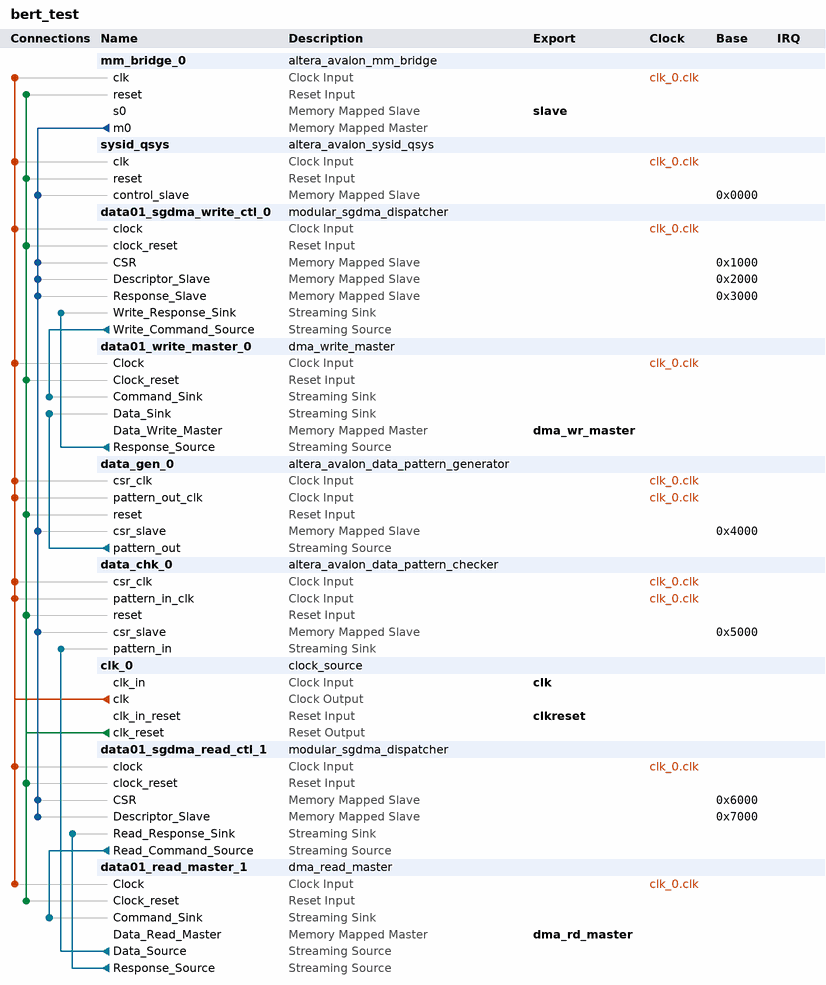
[diagram p0: system contents]
# Platform Designer (Qsys) system bert_test, Cyclone V 5CSXFC6C6U23C7
# Parameters at their usual value, and those the tool derives, are not listed.
package require -exact qsys 13.1
create_system bert_test
set_project_property DEVICE_FAMILY {Cyclone V}
set_project_property DEVICE 5CSXFC6C6U23C7

add_instance mm_bridge_0 altera_avalon_mm_bridge 13.1
set_instance_parameter_value mm_bridge_0 DATA_WIDTH 32
set_instance_parameter_value mm_bridge_0 ADDRESS_WIDTH 15
set_instance_parameter_value mm_bridge_0 ADDRESS_UNITS SYMBOLS
set_instance_parameter_value mm_bridge_0 MAX_PENDING_RESPONSES 4

add_instance sysid_qsys altera_avalon_sysid_qsys 13.1
set_instance_parameter_value sysid_qsys id 538181927

add_instance data01_sgdma_write_ctl_0 modular_sgdma_dispatcher 1.0
set_instance_parameter_value data01_sgdma_write_ctl_0 MODE 2
set_instance_parameter_value data01_sgdma_write_ctl_0 GUI_RESPONSE_PORT 0
set_instance_parameter_value data01_sgdma_write_ctl_0 DESCRIPTOR_FIFO_DEPTH 128
set_instance_parameter_value data01_sgdma_write_ctl_0 ENHANCED_FEATURES 1
set_instance_parameter_value data01_sgdma_write_ctl_0 CSR_ADDRESS_WIDTH 3

add_instance data01_write_master_0 dma_write_master 1.0
set_instance_parameter_value data01_write_master_0 DATA_WIDTH 64
set_instance_parameter_value data01_write_master_0 LENGTH_WIDTH 32
set_instance_parameter_value data01_write_master_0 FIFO_DEPTH 1024
set_instance_parameter_value data01_write_master_0 STRIDE_ENABLE 0
set_instance_parameter_value data01_write_master_0 GUI_STRIDE_WIDTH 1
set_instance_parameter_value data01_write_master_0 BURST_ENABLE 1
set_instance_parameter_value data01_write_master_0 GUI_MAX_BURST_COUNT 256
set_instance_parameter_value data01_write_master_0 GUI_PROGRAMMABLE_BURST_ENABLE 0
set_instance_parameter_value data01_write_master_0 GUI_BURST_WRAPPING_SUPPORT 1
set_instance_parameter_value data01_write_master_0 TRANSFER_TYPE {Aligned Accesses}
set_instance_parameter_value data01_write_master_0 PACKET_ENABLE 0
set_instance_parameter_value data01_write_master_0 ERROR_ENABLE 0
set_instance_parameter_value data01_write_master_0 ERROR_WIDTH 8
set_instance_parameter_value data01_write_master_0 ADDRESS_WIDTH 32
set_instance_parameter_value data01_write_master_0 FIFO_SPEED_OPTIMIZATION 1

add_instance data_gen_0 altera_avalon_data_pattern_generator 13.1
set_instance_parameter_value data_gen_0 ST_DATA_W 64
set_instance_parameter_value data_gen_0 BYPASS_ENABLED false
set_instance_parameter_value data_gen_0 AVALON_ENABLED true
set_instance_parameter_value data_gen_0 FREQ_CNTER_ENABLED false
set_instance_parameter_value data_gen_0 CROSS_CLK_SYNC_DEPTH 2

add_instance data_chk_0 altera_avalon_data_pattern_checker 13.1
set_instance_parameter_value data_chk_0 ST_DATA_W 64
set_instance_parameter_value data_chk_0 NUM_CYCLES_FOR_LOCK 40
set_instance_parameter_value data_chk_0 BYPASS_ENABLED false
set_instance_parameter_value data_chk_0 AVALON_ENABLED true
set_instance_parameter_value data_chk_0 FREQ_CNTER_ENABLED false
set_instance_parameter_value data_chk_0 CROSS_CLK_SYNC_DEPTH 2

add_instance clk_0 clock_source 13.1
set_instance_parameter_value clk_0 clockFrequency 100000000

add_instance data01_sgdma_read_ctl_1 modular_sgdma_dispatcher 1.0
set_instance_parameter_value data01_sgdma_read_ctl_1 MODE 1
set_instance_parameter_value data01_sgdma_read_ctl_1 GUI_RESPONSE_PORT 0
set_instance_parameter_value data01_sgdma_read_ctl_1 DESCRIPTOR_FIFO_DEPTH 128
set_instance_parameter_value data01_sgdma_read_ctl_1 ENHANCED_FEATURES 1
set_instance_parameter_value data01_sgdma_read_ctl_1 CSR_ADDRESS_WIDTH 3

add_instance data01_read_master_1 dma_read_master 1.0
set_instance_parameter_value data01_read_master_1 DATA_WIDTH 64
set_instance_parameter_value data01_read_master_1 LENGTH_WIDTH 32
set_instance_parameter_value data01_read_master_1 FIFO_DEPTH 2048
set_instance_parameter_value data01_read_master_1 STRIDE_ENABLE 0
set_instance_parameter_value data01_read_master_1 GUI_STRIDE_WIDTH 1
set_instance_parameter_value data01_read_master_1 BURST_ENABLE 1
set_instance_parameter_value data01_read_master_1 GUI_MAX_BURST_COUNT 512
set_instance_parameter_value data01_read_master_1 GUI_PROGRAMMABLE_BURST_ENABLE 0
set_instance_parameter_value data01_read_master_1 GUI_BURST_WRAPPING_SUPPORT 1
set_instance_parameter_value data01_read_master_1 TRANSFER_TYPE {Aligned Accesses}
set_instance_parameter_value data01_read_master_1 PACKET_ENABLE 0
set_instance_parameter_value data01_read_master_1 ERROR_ENABLE 0
set_instance_parameter_value data01_read_master_1 ERROR_WIDTH 8
set_instance_parameter_value data01_read_master_1 CHANNEL_ENABLE 0
set_instance_parameter_value data01_read_master_1 CHANNEL_WIDTH 8
set_instance_parameter_value data01_read_master_1 ADDRESS_WIDTH 32
set_instance_parameter_value data01_read_master_1 FIFO_SPEED_OPTIMIZATION 1

# connections
add_connection clk_0.clk data01_read_master_1.Clock clock
add_connection clk_0.clk data01_sgdma_read_ctl_1.clock clock
add_connection clk_0.clk data01_sgdma_write_ctl_0.clock clock
add_connection clk_0.clk data01_write_master_0.Clock clock
add_connection clk_0.clk data_chk_0.csr_clk clock
add_connection clk_0.clk data_chk_0.pattern_in_clk clock
add_connection clk_0.clk data_gen_0.csr_clk clock
add_connection clk_0.clk data_gen_0.pattern_out_clk clock
add_connection clk_0.clk mm_bridge_0.clk clock
add_connection clk_0.clk sysid_qsys.clk clock
add_connection clk_0.clk_reset data01_read_master_1.Clock_reset reset
add_connection clk_0.clk_reset data01_sgdma_read_ctl_1.clock_reset reset
add_connection clk_0.clk_reset data01_sgdma_write_ctl_0.clock_reset reset
add_connection clk_0.clk_reset data01_write_master_0.Clock_reset reset
add_connection clk_0.clk_reset data_chk_0.reset reset
add_connection clk_0.clk_reset data_gen_0.reset reset
add_connection clk_0.clk_reset mm_bridge_0.reset reset
add_connection clk_0.clk_reset sysid_qsys.reset reset
add_connection mm_bridge_0.m0 data01_sgdma_read_ctl_1.CSR avalon
set_connection_parameter_value mm_bridge_0.m0/data01_sgdma_read_ctl_1.CSR baseAddress 0x6000
add_connection mm_bridge_0.m0 data01_sgdma_read_ctl_1.Descriptor_Slave avalon
set_connection_parameter_value mm_bridge_0.m0/data01_sgdma_read_ctl_1.Descriptor_Slave baseAddress 0x7000
add_connection mm_bridge_0.m0 data01_sgdma_write_ctl_0.CSR avalon
set_connection_parameter_value mm_bridge_0.m0/data01_sgdma_write_ctl_0.CSR baseAddress 0x1000
add_connection mm_bridge_0.m0 data01_sgdma_write_ctl_0.Descriptor_Slave avalon
set_connection_parameter_value mm_bridge_0.m0/data01_sgdma_write_ctl_0.Descriptor_Slave baseAddress 0x2000
add_connection mm_bridge_0.m0 data01_sgdma_write_ctl_0.Response_Slave avalon
set_connection_parameter_value mm_bridge_0.m0/data01_sgdma_write_ctl_0.Response_Slave baseAddress 0x3000
add_connection mm_bridge_0.m0 data_chk_0.csr_slave avalon
set_connection_parameter_value mm_bridge_0.m0/data_chk_0.csr_slave baseAddress 0x5000
add_connection mm_bridge_0.m0 data_gen_0.csr_slave avalon
set_connection_parameter_value mm_bridge_0.m0/data_gen_0.csr_slave baseAddress 0x4000
add_connection mm_bridge_0.m0 sysid_qsys.control_slave avalon
set_connection_parameter_value mm_bridge_0.m0/sysid_qsys.control_slave baseAddress 0x0000
add_connection data01_read_master_1.Data_Source data_chk_0.pattern_in avalon_streaming
add_connection data01_read_master_1.Response_Source data01_sgdma_read_ctl_1.Read_Response_Sink avalon_streaming
add_connection data01_sgdma_read_ctl_1.Read_Command_Source data01_read_master_1.Command_Sink avalon_streaming
add_connection data01_sgdma_write_ctl_0.Write_Command_Source data01_write_master_0.Command_Sink avalon_streaming
add_connection data01_write_master_0.Response_Source data01_sgdma_write_ctl_0.Write_Response_Sink avalon_streaming
add_connection data_gen_0.pattern_out data01_write_master_0.Data_Sink avalon_streaming

# exported interfaces
add_interface clk clock sink
set_interface_property clk EXPORT_OF clk_0.clk_in
add_interface clkreset reset sink
set_interface_property clkreset EXPORT_OF clk_0.clk_in_reset
add_interface slave avalon slave
set_interface_property slave EXPORT_OF mm_bridge_0.s0
add_interface dma_wr_master avalon master
set_interface_property dma_wr_master EXPORT_OF data01_write_master_0.Data_Write_Master
add_interface dma_rd_master avalon master
set_interface_property dma_rd_master EXPORT_OF data01_read_master_1.Data_Read_Master

set_interconnect_requirement {$system} qsys_mm.clockCrossingAdapter HANDSHAKE
set_interconnect_requirement {$system} qsys_mm.maxAdditionalLatency 1

save_system bert_test.qsys
